# Altium schematic sheet FPGA_7A35T_POWER.SchDoc: Sayma RTM
size 420 x 297 mm; $$Internal___BlkDate: 23:43:25_12-13-18; $$Internal_NAME_PLACEHOLDER: a3sheet; $$Internal_Resolution: 00001mm; $$NotCommonProperty_@NAME: FPGA_7A15T_POWER; $$NotCommonProperty_@PRINTORDER: 2; $$NotCommonProperty_@SHEET: 1; $$NotCommonProperty_@SHEETTOTAL: 1; CmpIndex: 0; Drawing Author: G.Kasprowicz; Drawing Number: Sayma RTM; Drawing Project: 8 channel SAWG; Drawing Revision: 2.0; SymIndex: 2227; Author: G.Kasprowicz; CompanyName: WUT ISE; DrawnBy: G.Kasprowicz; Organization: WUT ISE; Address1: PW ISE; Address2: Nowowiejska 15/19 00-665 Warsaw; Address3: gkasprow@gmail.com; DocumentNumber: 9; Revision: 1.0; SheetNumber: 9; SheetTotal: 18; ModifiedBy: -; CheckedDate: -; Title2: FPGA supply; DivGrp: WUT ISE; Designer: G.Kasprowicz; ModifiedDate: -; ProjectName: Sensor Box
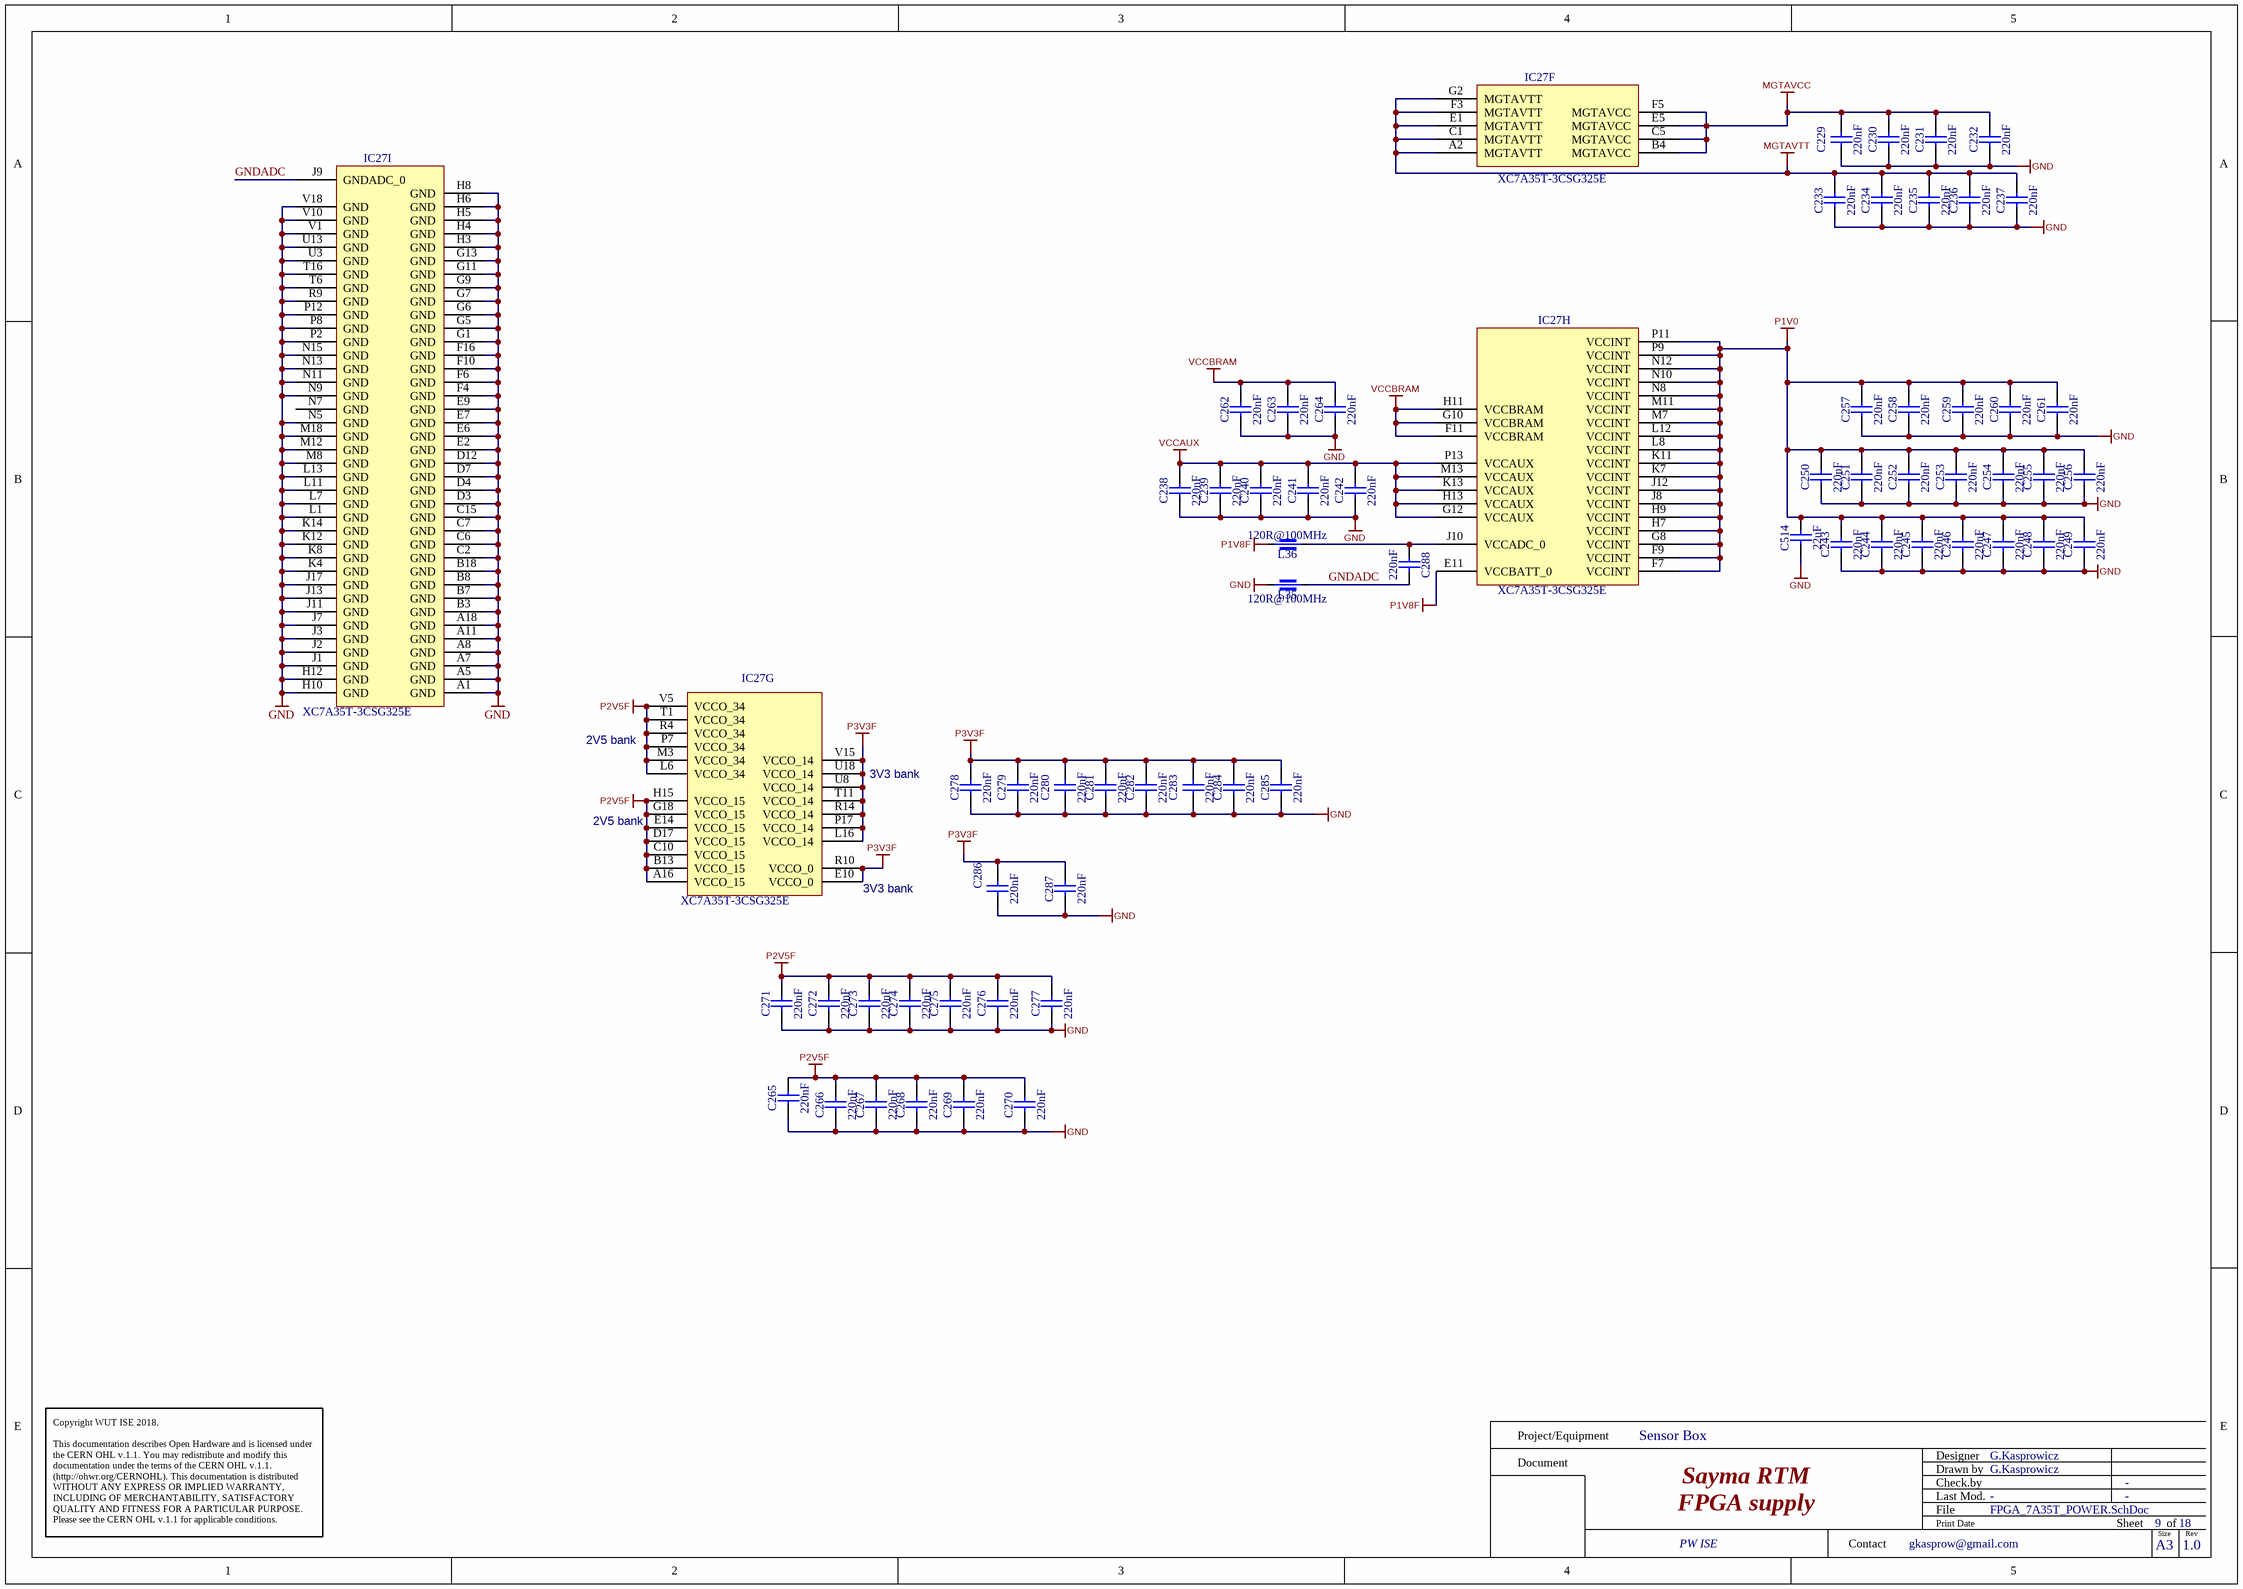
[diagram p0: FPGA_7A35T_POWER.SchDoc]

## Parts
C229  220nF  [CAPC0603X33N]
C230  220nF  [CAPC0603X33N]
C231  220nF  [CAPC0603X33N]
C232  220nF  [CAPC0603X33N]
C233  220nF  [CAPC0603X33N]
C234  220nF  [CAPC0603X33N]
C235  220nF  [CAPC0603X33N]
C236  220nF  [CAPC0603X33N]
C237  220nF  [CAPC0603X33N]
C238  220nF  [CAPC0603X33N]
C239  220nF  [CAPC0603X33N]
C240  220nF  [CAPC0603X33N]
C241  220nF  [CAPC0603X33N]
C242  220nF  [CAPC0603X33N]
C243  220nF  [CAPC0603X33N]
C244  220nF  [CAPC0603X33N]
C245  220nF  [CAPC0603X33N]
C246  220nF  [CAPC0603X33N]
C247  220nF  [CAPC0603X33N]
C248  220nF  [CAPC0603X33N]
C249  220nF  [CAPC0603X33N]
C250  220nF  [CAPC0603X33N]
C251  220nF  [CAPC0603X33N]
C252  220nF  [CAPC0603X33N]
C253  220nF  [CAPC0603X33N]
C254  220nF  [CAPC0603X33N]
C255  220nF  [CAPC0603X33N]
C256  220nF  [CAPC0603X33N]
C257  220nF  [CAPC0603X33N]
C258  220nF  [CAPC0603X33N]
C259  220nF  [CAPC0603X33N]
C260  220nF  [CAPC0603X33N]
C261  220nF  [CAPC0603X33N]
C262  220nF  [CAPC0603X33N]
C263  220nF  [CAPC0603X33N]
C264  220nF  [CAPC0603X33N]
C265  220nF  [CAPC0603X33N]
C266  220nF  [CAPC0603X33N]
C267  220nF  [CAPC0603X33N]
C268  220nF  [CAPC0603X33N]
C269  220nF  [CAPC0603X33N]
C270  220nF  [CAPC0603X33N]
C271  220nF  [CAPC0603X33N]
C272  220nF  [CAPC0603X33N]
C273  220nF  [CAPC0603X33N]
C274  220nF  [CAPC0603X33N]
C275  220nF  [CAPC0603X33N]
C276  220nF  [CAPC0603X33N]
C277  220nF  [CAPC0603X33N]
C278  220nF  [CAPC0603X33N]
C279  220nF  [CAPC0603X33N]
C280  220nF  [CAPC0603X33N]
C281  220nF  [CAPC0603X33N]
C282  220nF  [CAPC0603X33N]
C283  220nF  [CAPC0603X33N]
C284  220nF  [CAPC0603X33N]
C285  220nF  [CAPC0603X33N]
C286  220nF  [CAPC0603X33N]
C287  220nF  [CAPC0603X33N]
C288  220nF  [CAPC0603X33N]
C514  22uF  [CAPC2012X135N]
IC27  XC7A35T-3CSG325E  [CSG325]  (parts F,G,H,I of 9)
L35  120R@100MHz  [INDC1005X55N]
L36  120R@100MHz  [INDC1005X55N]

## Nets
GND: C229.1 C230.1 C231.1 C232.1 C233.1 C234.1 C235.1 C236.1 C237.1 C238.1 C239.1 C240.1 C241.1 C242.1 C243.1 C244.1 C245.1 C246.1 C247.1 C248.1 C249.1 C250.1 C251.1 C252.1 C253.1 C254.1 C255.1 C256.1 C257.1 C258.1 C259.1 C260.1 C261.1 C262.1 C263.1 C264.1 C265.1 C266.1 C267.1 C268.1 C269.1 C270.1 C271.1 C272.1 C273.1 C274.1 C275.1 C276.1 C277.1 C278.1 C279.1 C280.1 C281.1 C282.1 C283.1 C284.1 C285.1 C286.1 C287.1 C514.1 IC27.A1(GND) IC27.A5(GND) IC27.A7(GND) IC27.A8(GND) IC27.A11(GND) IC27.A18(GND) IC27.B3(GND) IC27.B7(GND) IC27.B8(GND) IC27.B18(GND) IC27.C2(GND) IC27.C6(GND) IC27.C7(GND) IC27.C15(GND) IC27.D3(GND) IC27.D4(GND) IC27.D7(GND) IC27.D12(GND) IC27.E2(GND) IC27.E6(GND) IC27.E7(GND) IC27.E9(GND) IC27.F4(GND) IC27.F6(GND) IC27.F10(GND) IC27.F16(GND) IC27.G1(GND) IC27.G5(GND) IC27.G6(GND) IC27.G7(GND) IC27.G9(GND) IC27.G11(GND) IC27.G13(GND) IC27.H3(GND) IC27.H4(GND) IC27.H5(GND) IC27.H6(GND) IC27.H8(GND) IC27.H10(GND) IC27.H12(GND) IC27.J1(GND) IC27.J2(GND) IC27.J3(GND) IC27.J7(GND) IC27.J11(GND) IC27.J13(GND) IC27.J17(GND) IC27.K4(GND) IC27.K8(GND) IC27.K12(GND) IC27.K14(GND) IC27.L1(GND) IC27.L7(GND) IC27.L11(GND) IC27.L13(GND) IC27.M8(GND) IC27.M12(GND) IC27.M18(GND) IC27.N5(GND) IC27.N9(GND) IC27.N11(GND) IC27.N13(GND) IC27.N15(GND) IC27.P2(GND) IC27.P8(GND) IC27.P12(GND) IC27.R9(GND) IC27.T6(GND) IC27.T16(GND) IC27.U3(GND) IC27.U13(GND) IC27.V1(GND) IC27.V10(GND) IC27.V18(GND) L35.1
MGTAVCC: C229.2 C230.2 C231.2 C232.2 IC27.B4(MGTAVCC) IC27.C5(MGTAVCC) IC27.E5(MGTAVCC) IC27.F5(MGTAVCC)
MGTAVTT: C233.2 C234.2 C235.2 C236.2 C237.2 IC27.A2(MGTAVTT) IC27.C1(MGTAVTT) IC27.E1(MGTAVTT) IC27.F3(MGTAVTT) IC27.G2(MGTAVTT)
P1V0: C243.2 C244.2 C245.2 C246.2 C247.2 C248.2 C249.2 C250.2 C251.2 C252.2 C253.2 C254.2 C255.2 C256.2 C257.2 C258.2 C259.2 C260.2 C261.2 C514.2 IC27.F7(VCCINT) IC27.F9(VCCINT) IC27.G8(VCCINT) IC27.H7(VCCINT) IC27.H9(VCCINT) IC27.J8(VCCINT) IC27.J12(VCCINT) IC27.K7(VCCINT) IC27.K11(VCCINT) IC27.L8(VCCINT) IC27.L12(VCCINT) IC27.M7(VCCINT) IC27.M11(VCCINT) IC27.N8(VCCINT) IC27.N10(VCCINT) IC27.N12(VCCINT) IC27.P9(VCCINT) IC27.P11(VCCINT)
P1V8F: IC27.E11(VCCBATT_0) L36.1
P2V5F: C265.2 C266.2 C267.2 C268.2 C269.2 C270.2 C271.2 C272.2 C273.2 C274.2 C275.2 C276.2 C277.2 IC27.A16(VCCO_15) IC27.B13(VCCO_15) IC27.C10(VCCO_15) IC27.D17(VCCO_15) IC27.E14(VCCO_15) IC27.G18(VCCO_15) IC27.H15(VCCO_15) IC27.L6(VCCO_34) IC27.M3(VCCO_34) IC27.P7(VCCO_34) IC27.R4(VCCO_34) IC27.T1(VCCO_34) IC27.V5(VCCO_34)
P3V3F: C278.2 C279.2 C280.2 C281.2 C282.2 C283.2 C284.2 C285.2 C286.2 C287.2 IC27.E10(VCCO_0) IC27.L16(VCCO_14) IC27.P17(VCCO_14) IC27.R10(VCCO_0) IC27.R14(VCCO_14) IC27.T11(VCCO_14) IC27.U8(VCCO_14) IC27.U18(VCCO_14) IC27.V15(VCCO_14)
VCCAUX: C238.2 C239.2 C240.2 C241.2 C242.2 IC27.G12(VCCAUX) IC27.H13(VCCAUX) IC27.K13(VCCAUX) IC27.M13(VCCAUX) IC27.P13(VCCAUX)
VCCBRAM: C262.2 C263.2 C264.2 IC27.F11(VCCBRAM) IC27.G10(VCCBRAM) IC27.H11(VCCBRAM)
GNDADC: C288.2 IC27.J9(GNDADC_0) L35.2
NetC288_1: C288.1 IC27.J10(VCCADC_0) L36.2

Not connected (* = marked no-connect by the designer): IC27 N7(GND)

## Notes on the sheet
- (near IC27) 2V5 bank
- 3V3 bank
- (near IC27) 3V3 bank
- Project/Equipment
- Document
- Designer
- Drawn by
- Check.by
- Copyright WUT ISE 2018.
  This documentation describes Open Hardware and is licensed under the CERN OHL v.1.1. You may redistribute and modify this documentation under the terms of the CERN OHL v.1.1. (http://ohwr.org/CERNOHL). This documentation is distributed WITHOUT ANY EXPRESS OR IMPLIED WARRANTY, INCLUDING OF MERCHANTABILITY, SATISFACTORY QUALITY AND FITNESS FOR A PARTICULAR PURPOSE. Please see the CERN OHL v.1.1 for applicable conditions.
- Contact
- File
- Last Mod.
- Print Date
- Sheet
- Size
- A3
- of
- Rev

## Library data of the parts
C229-C288 = CC0201_220NF_6.3V_20%_X5R: Non-polarised capacitor; Manufacturer: GENERIC; Manufacturer1 Part Number: JMK063BJ224MP-F; Part Description: SMD Multilayer Chip Ceramic Capacitor; TC: X5R; Tolerance: ±20%; Voltage: 6.3V; Case: 0201; Manufacturer Part Number: CC0201_220NF_6.3V_20%_X5R; Manufacturer1 Example: TAIYO YUDEN; Part Number: CC0201_220NF_6.3V_20%_X5R; Pin Count: 2; SMD: Yes; Status: Not Recommended; Value: 220nF; Component Kind: Standard; Component Type: Standard; Mounted: Yes; Socket: No; Sense: No; Manufacturer1 ComponentHeight: 0.33mm; HelpURL: \\cern.ch\dfs\Applications\Altium\Datasheets\CC0201_X5R_TAIYO-YUDEN_STANDARD-CLASS2.pdf; Author: CERN DEM JLC; CreateDate: 27.05.2010; LatestRevisionDate: 27.05.2010
C514 = CC0805_22UF_6.3V_20%_X5R: Non-polarised capacitor; Manufacturer: GENERIC; Manufacturer1 Part Number: C0805C226M9PAC7800; Part Description: SMD Multilayer Chip Ceramic Capacitor; TC: X5R; Tolerance: ±20%; Voltage: 6.3V; Case: 0805; Manufacturer Part Number: CC0805_22UF_6.3V_20%_X5R; Manufacturer1 Example: KEMET; Part Number: CC0805_22UF_6.3V_20%_X5R; Pin Count: 2; SMD: Yes; Status: Preferred; Value: 22uF; Component Kind: Standard; Component Type: Standard; Mounted: Yes; Socket: No; Sense: No; Manufacturer1 ComponentHeight: 1.45mm; HelpURL: \\cern.ch\dfs\Applications\Altium\Datasheets\CC1206_X5R_KEMET.pdf; Author: CERN DEM JLC; CreateDate: 03.12.2007; LatestRevisionDate: 03.12.2007
IC27 = CMP-0383-00015-1: Artix-7 FPGA, 150 User I/Os, 4 GTP, 324-Ball BGA, Speed Grade 3, Extended Grade, Pb-Free; Manufacturer: Xilinx; CMTs: 5; Available User I/O: 150; GTP: 4; Speed Grades: 3; Total Block RAM: 1800 Kb; Logic Cells: 33280; ComponentLink3URL: http://www.xilinx.com/support/documentation/user_guides/ug475_7Series_Pkg_Pinout.pdf; ComponentLink3Description: Pinout; Operating Temperature Range: Extended; PackageReference: CSG-325; PackageDescription: 324-Ball Wire-Bond Chip-Scale BGA, Body 15 x 15 mm, Pitch 0.8 mm; ComponentLink4URL: http://www.xilinx.com/support/documentation/user_guides/ug475_7Series_Pkg_Pinout.pdf; ComponentLink1Description: Manufacturer URL; ComponentLink2Description: Datasheet; DatasheetVersion: Rev. 1.15; PartNumber: XC7A35T-3CSG325E; Mounting Technology: Surface Mount; ComponentLink1URL: http://www.xilinx.com/; PackageVersion: Rev. 1.11; ComponentLink2URL: http://www.xilinx.com/support/documentation/data_sheets/ds180_7Series_Overview.pdf; Maximum Distributed RAM: 400 Kb; ComponentLink4Description: Package Specification
L35 L36 = IND0402_MURATA_BLM15PX121SN1D: Manufacturer: MURATA; Part Description: SMD EMIFIL Chip Ferrite Bead; Power: 2A; Resistance: 0.055R; Tolerance: ±25%; Case: 0402; ComponentHeight: 0.55mm; Manufacturer Part Number: BLM15PX121SN1D; Part Number: IND0402_MURATA_BLM15PX121SN1D; Pin Count: 2; SMD: Yes; Value: 120R@100MHz; Component Kind: Standard; Component Type: Standard; Status: None; Mounted: Yes; Socket: No; Sense: No; HelpURL: \\cern.ch\dfs\Applications\Altium\Datasheets\IND0402_MURATA_BLM15PX.pdf; Author: CERN DEM JMW; CreateDate: 19.02.2014; LatestRevisionDate: 25.10.2018